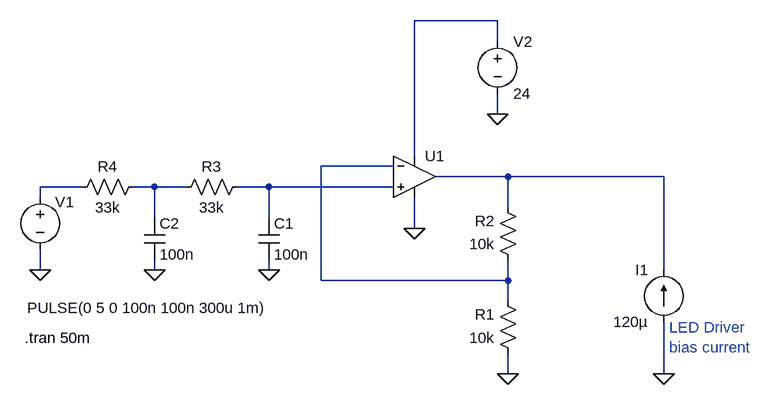
[diagram p0: schematic PWM_to_0-10V_LT Spicel simulation.asc]
PWM_to_0-10V_LT Spicel simulation.asc, the LTspice schematic file:
Version 4
SHEET 1 920 680
WIRE 512 -272 384 -272
WIRE 512 -240 512 -272
WIRE 512 -128 512 -160
WIRE 384 -64 384 -272
WIRE 352 -48 240 -48
WIRE 528 -32 416 -32
WIRE 768 -32 528 -32
WIRE -128 -16 -192 -16
WIRE -16 -16 -48 -16
WIRE 32 -16 -16 -16
WIRE 160 -16 112 -16
WIRE 352 -16 160 -16
WIRE -192 0 -192 -16
WIRE 528 16 528 -32
WIRE -16 32 -16 -16
WIRE 160 32 160 -16
WIRE 384 48 384 0
WIRE -192 112 -192 80
WIRE -16 112 -16 96
WIRE 160 112 160 96
WIRE 768 112 768 -32
WIRE 240 128 240 -48
WIRE 528 128 528 96
WIRE 528 128 240 128
WIRE 528 160 528 128
WIRE 528 272 528 240
WIRE 768 272 768 192
FLAG -192 112 0
FLAG 528 272 0
FLAG 384 48 0
FLAG 512 -128 0
FLAG 160 112 0
FLAG -16 112 0
FLAG 768 272 0
SYMBOL voltage -192 -16 R0
WINDOW 3 -20 186 Left 2
WINDOW 123 0 0 Left 0
WINDOW 39 0 0 Left 0
WINDOW 0 23 23 Left 2
SYMATTR Value PULSE(0 5 0 100n 100n 300u 1m)
SYMATTR InstName V1
SYMBOL OpAmps\\UniversalOpAmp 384 -32 R0
SYMATTR InstName U1
SYMBOL res 544 256 R180
WINDOW 0 36 76 Left 2
WINDOW 3 36 40 Left 2
SYMATTR InstName R1
SYMATTR Value 10k
SYMBOL res 544 112 R180
WINDOW 0 36 76 Left 2
WINDOW 3 36 40 Left 2
SYMATTR InstName R2
SYMATTR Value 10k
SYMBOL voltage 512 -256 R0
WINDOW 123 0 0 Left 0
WINDOW 39 0 0 Left 0
SYMATTR InstName V2
SYMATTR Value 24
SYMBOL cap 144 32 R0
SYMATTR InstName C1
SYMATTR Value 100n
SYMBOL cap -32 32 R0
SYMATTR InstName C2
SYMATTR Value 100n
SYMBOL res 128 -32 R90
WINDOW 0 0 56 VBottom 2
WINDOW 3 32 56 VTop 2
SYMATTR InstName R3
SYMATTR Value 33k
SYMBOL res -32 -32 R90
WINDOW 0 0 56 VBottom 2
WINDOW 3 32 56 VTop 2
SYMATTR InstName R4
SYMATTR Value 33k
SYMBOL current 768 192 R180
WINDOW 0 24 80 Left 2
WINDOW 3 24 0 Left 2
WINDOW 123 0 0 Left 0
WINDOW 39 0 0 Left 0
SYMATTR InstName I1
SYMATTR Value 120µ
TEXT -216 216 Left 2 !.tran 50m
TEXT 776 200 Left 2 ;LED Driver \nbias current

The netlist it stands for:
* PWM_to_0-10V_LT Spicel simulation.asc
V1 N004 0 PULSE(0 5 0 100n 100n 300u 1m)
XU1 N006 N002 N001 0 N003 level1 Avol=1Meg GBW=10Meg Vos=0 En=0 Enk=0 In=0 Ink=0 Rin=500Meg  ; pins In+ In- V+ V- OUT
R1 0 N002 10k
R2 N002 N003 10k
V2 N001 0 24
C1 N006 0 100n
C2 N005 0 100n
R3 N006 N005 33k
R4 N005 N004 33k
I1 0 N003 120µ
.tran 50m
* LED Driver
* bias current
.lib UniversalOpAmp1.lib
.backanno
.end